# Altium schematic sheet TopLevel.SchDoc
size A
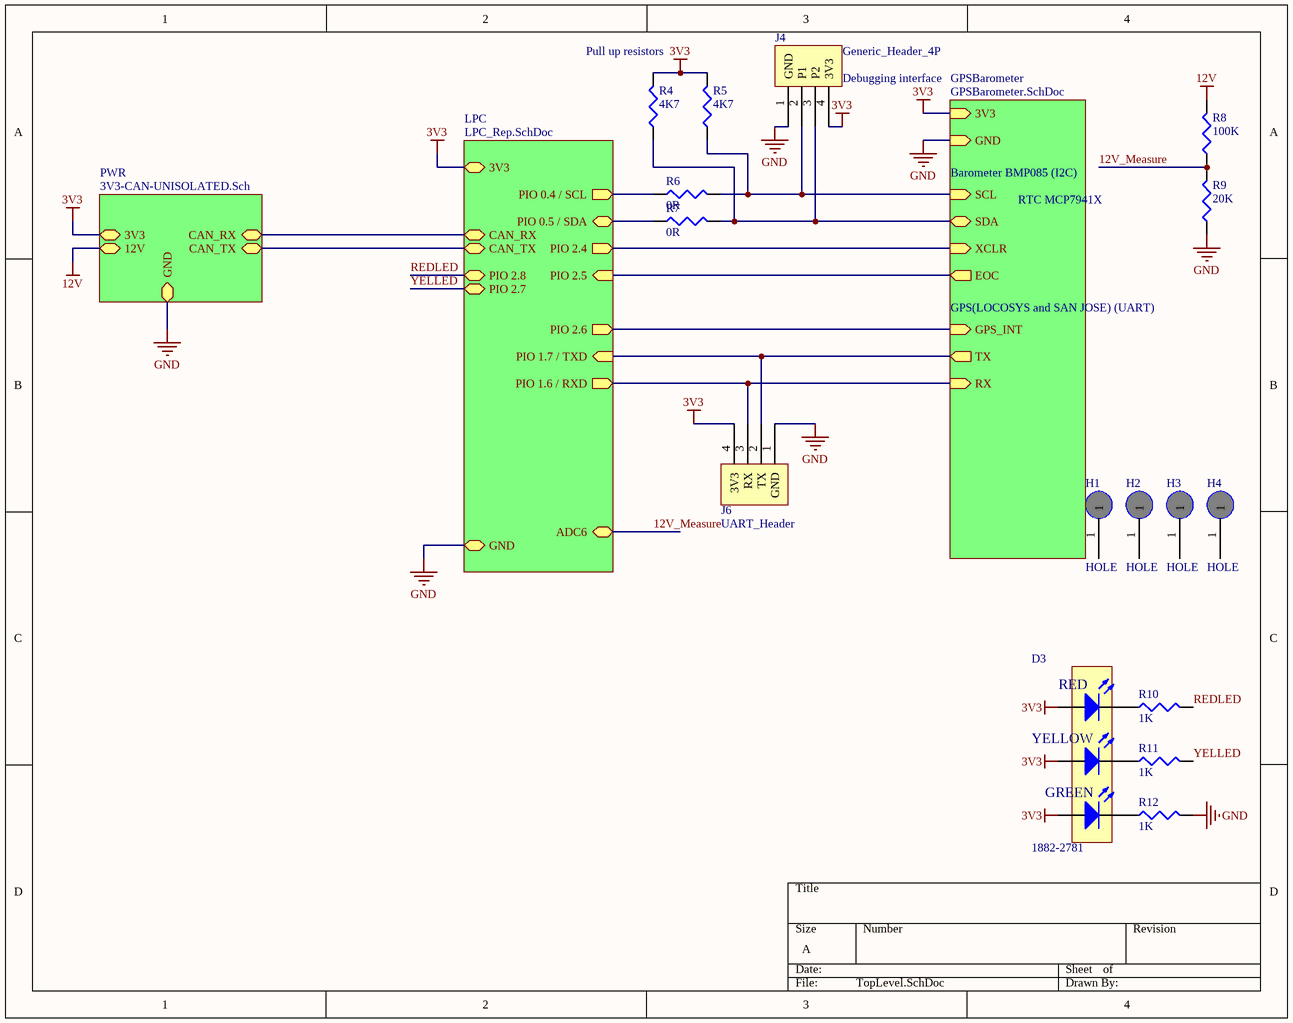
[diagram p0: TopLevel.SchDoc]

## Parts
D3  1882-2781  [LED_TRILEVEL]
H1  HOLE  [M2.5]
H2  HOLE  [M2.5]
H3  HOLE  [M2.5]
H4  HOLE  [M2.5]
J4  Generic_Header_4P  [IDC4]
J6  UART_Header  [IDC4]
R4  4K7  [0603]
R5  4K7  [0603]
R6  0R  [0603]
R7  0R  [0603]
R8  100K  [0603]
R9  20K  [0603]
R10  1K  [0603]
R11  1K  [0603]
R12  1K  [0603]

## Sub-sheets
GPSBarometer = GPSBarometer.SchDoc: 3V3 (in), RX (in), TX (out), SDA (bidir), SCL (in), XCLR (in), EOC (out), GPS_INT (in), GND (in)
LPC = LPC_Rep.SchDoc: PIO 0.4 / SCL (out), PIO 0.5 / SDA (bidir), 3V3 (bidir), CAN_RX (bidir), CAN_TX (bidir), PIO 1.6 / RXD (out), PIO 1.7 / TXD (in), ADC6 (bidir), PIO 2.5 (in), PIO 2.4 (out), PIO 2.8 (bidir), PIO 2.7 (bidir), PIO 2.6 (out), GND
PWR = 3V3-CAN-UNISOLATED.Sch: CAN_RX (bidir), CAN_TX (bidir), 3V3 (bidir), 12V (bidir), GND (bidir)

## Nets
3V3: D3.4(A) D3.5(A) D3.6(A) J4.4(3V3) J6.4(3V3) R4.2 R5.2 ; sheet LPC/3V3, sheet PWR/3V3, sheet GPSBarometer/3V3
12V: R8.2 ; sheet PWR/12V
GND: J4.1(GND) J6.1(GND) R9.1 R12.2 ; sheet LPC/GND, sheet PWR/GND, sheet GPSBarometer/GND
12V_Measure: R8.1 R9.2 ; sheet LPC/ADC6
REDLED: R10.2 ; sheet LPC/PIO 2.8
YELLED: R11.2 ; sheet LPC/PIO 2.7
NetD3_1: D3.1(K) R12.1
NetD3_2: D3.2(K) R11.1
NetD3_3: D3.3(K) R10.1
NetJ4_2: J4.2(P1) R5.1 R6.2 ; sheet GPSBarometer/SCL
NetJ4_3: J4.3(P2) R4.1 R7.2 ; sheet GPSBarometer/SDA
NetJ6_2: J6.2(TX) ; sheet LPC/PIO 1.7 / TXD, sheet GPSBarometer/TX
NetJ6_3: J6.3(RX) ; sheet LPC/PIO 1.6 / RXD, sheet GPSBarometer/RX
NetR6_1: R6.1 ; sheet LPC/PIO 0.4 / SCL
NetR7_1: R7.1 ; sheet LPC/PIO 0.5 / SDA
(unnamed): sheet LPC/CAN_RX, sheet PWR/CAN_RX
(unnamed): sheet LPC/CAN_TX, sheet PWR/CAN_TX
(unnamed): sheet LPC/PIO 2.5, sheet GPSBarometer/EOC
(unnamed): sheet LPC/PIO 2.4, sheet GPSBarometer/XCLR
(unnamed): sheet LPC/PIO 2.6, sheet GPSBarometer/GPS_INT

Not connected (* = marked no-connect by the designer): H1 1; H2 1; H3 1; H4 1

## Notes on the sheet
- Pull up resistors
- (near J4) Debugging interface
- Barometer BMP085 (I2C)
- RTC MCP7941X
- GPS(LOCOSYS and SAN JOSE) (UART)
- (in symbol LED-TRILEVEL) RED; YELLOW; GREEN

## Library data of the parts
D3 = LED-TRILEVEL: Three level LED; Needed?: Farnell - Low Stock; Farnell: 1461596; Farnell Price: 4.56
H1-H4 = HOLE: Needed?: NO - Footprint
J4 = Generic_Header_4P: Needed?: NO - Common
J6 = UART_Header: Needed?: NO - Common
R4 R5 = RES1: Resistor; Value: 4.7k; Needed?: NO - HW LAB
R6-R12 = RES1: Resistor; Needed?: NO - HW LAB
  R6 R7: Value: 0R
  R8: Value: 100k
  R9: Value: 20k
  R10-R12: Value: 1k